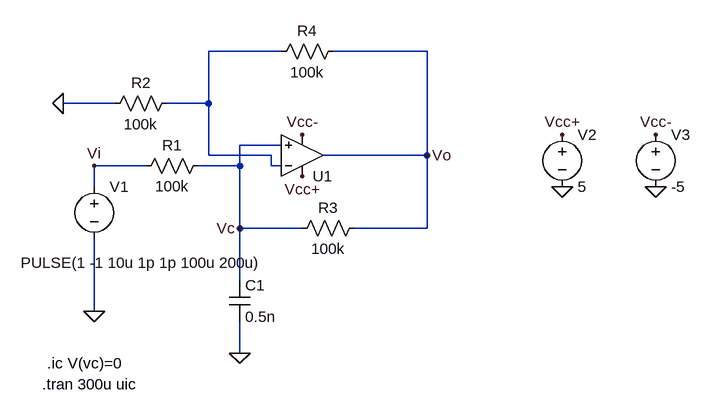
[diagram p0: schematic Ejercicio2a.asc]
Ejercicio2a.asc, the LTspice schematic file:
Version 4
SHEET 1 880 680
WIRE 128 32 16 32
WIRE 352 32 208 32
WIRE -128 112 -208 112
WIRE 16 112 16 32
WIRE 16 112 -48 112
WIRE 128 176 64 176
WIRE 16 192 16 112
WIRE 112 192 16 192
WIRE 352 192 352 32
WIRE 352 192 192 192
WIRE -80 208 -160 208
WIRE 64 208 64 176
WIRE 64 208 0 208
WIRE 112 208 112 192
WIRE 128 208 112 208
WIRE -160 240 -160 208
WIRE 64 304 64 208
WIRE 160 304 64 304
WIRE 352 304 352 192
WIRE 352 304 240 304
WIRE 64 384 64 304
WIRE -160 432 -160 320
WIRE 64 496 64 448
FLAG -160 432 0
FLAG 560 240 0
FLAG 704 240 0
FLAG 560 160 Vcc+
FLAG 704 160 Vcc-
FLAG 160 224 Vcc+
FLAG -208 112 0
FLAG 64 496 0
FLAG 352 192 Vo
FLAG -160 208 Vi
FLAG 64 304 Vc
FLAG 160 160 Vcc-
SYMBOL voltage -160 224 R0
WINDOW 3 -113 133 Left 2
SYMATTR Value PULSE(1 -1 10u 1p 1p 100u 200u)
SYMATTR InstName V1
SYMBOL res 16 192 R90
WINDOW 0 0 56 VBottom 2
WINDOW 3 32 56 VTop 2
SYMATTR InstName R1
SYMATTR Value 100k
SYMBOL voltage 560 144 R0
SYMATTR InstName V2
SYMATTR Value 5
SYMBOL voltage 704 144 R0
SYMATTR InstName V3
SYMATTR Value -5
SYMBOL res -32 96 R90
WINDOW 0 0 56 VBottom 2
WINDOW 3 32 56 VTop 2
SYMATTR InstName R2
SYMATTR Value 100k
SYMBOL res 256 288 R90
WINDOW 0 0 56 VBottom 2
WINDOW 3 32 56 VTop 2
SYMATTR InstName R3
SYMATTR Value 100k
SYMBOL cap 48 384 R0
SYMATTR InstName C1
SYMATTR Value 0.5n
SYMBOL res 224 16 R90
WINDOW 0 0 56 VBottom 2
WINDOW 3 32 56 VTop 2
SYMATTR InstName R4
SYMATTR Value 100k
SYMBOL UniversalOpamp2 160 192 M180
SYMATTR InstName U1
TEXT -240 544 Left 2 !.tran 300u uic
TEXT -232 512 Left 2 !.ic V(vc)=0

The netlist it stands for:
* Ejercicio2a.asc
V1 Vi 0 PULSE(1 -1 10u 1p 1p 100u 200u)
R1 Vc Vi 100k
V2 Vcc+ 0 5
V3 Vcc- 0 -5
R2 N001 0 100k
R3 Vo Vc 100k
C1 Vc 0 0.5n
R4 Vo N001 100k
XU1 Vc N001 Vcc+ Vcc- Vo level.2 Avol=1Meg GBW=10Meg Slew=10Meg ilimit=25m rail=0 Vos=0 phimargin=45 en=0 enk=0 in=0 ink=0 Rin=500Meg  ; pins IN+ IN- V+ V- OUT
.tran 300u uic
.ic V(vc)=0
.lib UniversalOpamps2.sub
.backanno
.end